# EAGLE design working (EAGLE 9.2.1)
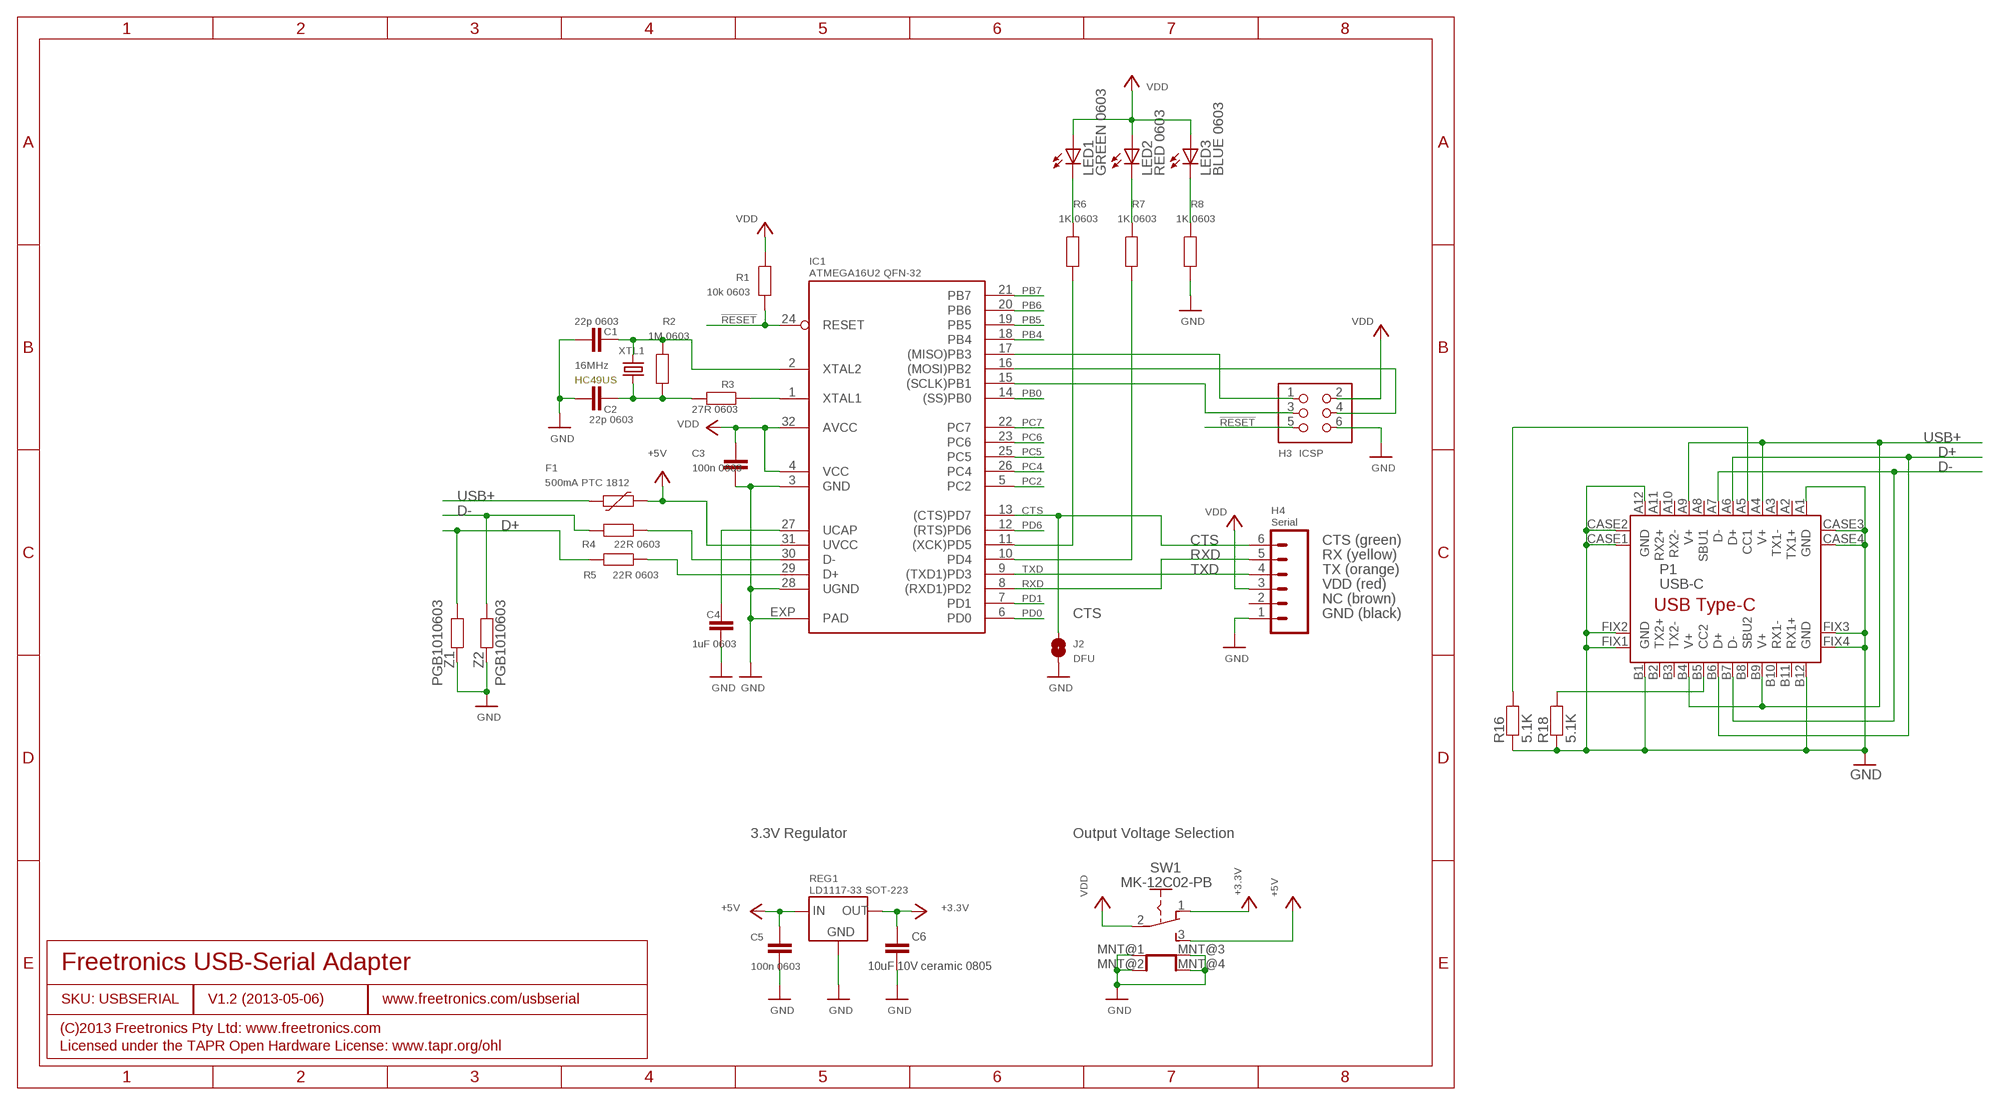
[diagram p0: schematic, sheet 1]

## Parts
C1  22p 0603  CAP0603  [0603]
C2  22p 0603  CAP0603  [0603]
C3  100n 0603  CAP0603  [0603]
C4  1uF 0603  CAP0603  [0603]
C5  100n 0603  CAP0603  [0603]
C6  10uF 10V ceramic 0805  C-EUC0805  [C0805]
F1  500mA PTC 1812  PTC  [1812]
H3  ICSP  HEADER_2X3  [HEADER_2X3]
H4  Serial  M06SIP  [1X06]
IC1  ATMEGA16U2 QFN-32  ATMEL_ATMEGA8U2-MUQFN  [ATMEL_QFN32]
J2  DFU  SJ  [SJ]
LED1  GREEN 0603  LED0603  [LED-0603]
LED2  RED 0603  LED0603  [LED-0603]
LED3  BLUE 0603  LED0603  [LED-0603]
P1  USB-C  [USB-C-U52A]
R1  10k 0603  RESISTOR0603  [0603]
R2  1M 0603  RESISTOR0603  [0603]
R3  27R 0603  RESISTOR0603  [0603]
R4  22R 0603  RESISTOR0603  [0603]
R5  22R 0603  RESISTOR0603  [0603]
R6  1K 0603  RESISTOR0603  [0603]
R7  1K 0603  RESISTOR0603  [0603]
R8  1K 0603  RESISTOR0603  [0603]
R16  5.1K  RESISTOR0603  [0603]
R18  5.1K  RESISTOR0603  [0603]
REG1  LD1117-33 SOT-223  LD1117-FIXED  [SOT-223]
SW1  MK-12C02-PB  SWITCH-SPDT-4TABSSMT  [MK-12C02]
XTL1  16MHz  CRYSTALHC49UV  [HC49U-V]
Z1  PGB1010603  RESISTOR0603  [0603]
Z2  PGB1010603  RESISTOR0603  [0603]

## Nets
!RESET: H3.5 IC1.24(RESET) R1.1
+3V3: C6.1 REG1.2(OUT) REG1.4(OUT) SW1.1(A) ; supply symbol labelled +3.3V
+5V: C5.1 F1.2 IC1.31(UVCC) REG1.3(IN) SW1.3(B)
CTS: H4.6 IC1.13((CTS)PD7) J2.2
D+: P1.A6(D+) P1.B6(D+) R5.2 Z1.1
D-: P1.A7(D-) P1.B7(D-) R4.2 Z2.1
GND: C1.1 C2.1 C3.2 C4.2 C5.2 C6.2 H3.6 H4.1 IC1.3(GND) IC1.28(UGND) IC1.EXP(PAD) J2.1 P1.A1(GND) P1.A12(GND) P1.B1(GND) P1.B12(GND) P1.CASE1(GND) P1.CASE2(GND) P1.CASE3(GND) P1.CASE4(GND) P1.FIX1(GND) P1.FIX2(GND) P1.FIX3(GND) P1.FIX4(GND) R8.1 R16.1 R18.1 REG1.1(GND) SW1.MNT@1(MNT) SW1.MNT@2(MNT) SW1.MNT@3(MNT) SW1.MNT@4(MNT) Z1.2 Z2.2
MISO: H3.1 IC1.17((MISO)PB3)
MOSI: H3.4 IC1.16((MOSI)PB2)
N$2: IC1.1(XTAL1) R3.1
N$3: LED1.C R6.2
N$4: P1.A5(CC1) R16.2
N$5: P1.B5(CC2) R18.2
N$7: LED2.C R7.2
N$9: LED3.C R8.2
N$113: C1.2 IC1.2(XTAL2) R2.2 XTL1.2
N$114: C2.2 R2.1 R3.2 XTL1.1
N$117: C4.1 IC1.27(UCAP)
PB0: IC1.14((SS)PB0)
PB4: IC1.18(PB4)
PB5: IC1.19(PB5)
PB6: IC1.20(PB6)
PB7: IC1.21(PB7)
PC2: IC1.5(PC2)
PC4: IC1.26(PC4)
PC5: IC1.25(PC5)
PC6: IC1.23(PC6)
PC7: IC1.22(PC7)
PD0: IC1.6(PD0)
PD1: IC1.7(PD1)
PD6: IC1.12((RTS)PD6)
RD+: IC1.29(D+) R5.1
RD-: IC1.30(D-) R4.1
RXD: H4.5 IC1.8((RXD1)PD2)
RXLED: IC1.10(PD4) R7.1
SCK: H3.3 IC1.15((SCLK)PB1)
TXD: H4.4 IC1.9((TXD1)PD3)
TXLED: IC1.11((XCK)PD5) R6.1
USB+: F1.1 P1.A4(V+) P1.A9(V+) P1.B4(V+) P1.B9(V+)
VDD: C3.1 H3.2 H4.3 IC1.4(VCC) IC1.32(AVCC) LED1.A LED2.A LED3.A R1.2 SW1.2(COM)
Unconnected: H4.2 P1.A2(TX1+) P1.A3(TX1-) P1.A8(SBU1) P1.A10(RX2-) P1.A11(RX2+) P1.B2(TX2+) P1.B3(TX2-) P1.B8(SBU2) P1.B10(RX1-) P1.B11(RX1+)

## Notes on the sheet
- HC49US
- CTS (green)
- RX (yellow)
- TX (orange)
- VDD (red)
- NC (brown)
- GND (black)
- 3.3V Regulator | Output Voltage Selection
- Freetronics USB-Serial Adapter
- SKU: USBSERIAL | V1.2 (2013-05-06) | www.freetronics.com/usbserial
- (C)2013 Freetronics Pty Ltd: www.freetronics.com
- Licensed under the TAPR Open Hardware License: www.tapr.org/ohl

## Library data of the parts
C1-C5 = freetronics:CAP: Capacitor Standard 0603 ceramic capacitor, and 0.1" leaded capacitor.
C6 = freetronics-jon:C-EU: CAPACITOR, European symbol
F1 = freetronics-luke:PTC: Polymeric PTC ("Polyfuse")
H3 = freetronics-luke:HEADER_2X3: 6-pin (2x3) 0.1" male through-hole pin header.
H4 = freetronics-master-v1:M06: Header 6 Standard 6-pin 0.1" header. Use with straight break away headers (SKU : PRT-00116), right angle break away headers (PRT-00553), swiss pins (PRT-00743), machine pins (PRT-00117), and female headers (PRT-00115). Molex polarized connector foot print use with SKU : PRT-08094 with associated crimp pins and housings. NOTES ON THE VARIANTS LOCK and LOCK_LONGPADS... This footprint was designed to help hold the alignment of a through-hole component (i.e. 6-pin header) while soldering it into place. You may notice that each hole has been shifted either up or down by 0.005 of an inch from it's more standard position (which is a perfectly straight line). This slight alteration caused the pins (the squares in the middle) to touch the edges of the holes. Because they are alternating, it causes a "brace" to hold the component in place. 0.005 has proven to be the perfect amount of "off-center" position when using our standard breakaway headers. Although looks a little odd when you look at the bare footprint, once you have a header in there, the alteration is very hard to notice. Also, if you push a header all the way into place, it is covered up entirely on the bottom side. This idea of altering the position of holes to aid alignment will be further integrated into the Sparkfun Library for other footprints. It can help hold any component with 3 or more connection pins.
IC1 = freetronics-jon:ATMEL_ATMEGA8U2-MU
J2 = freetronics-luke:SJ: PCB "solder jumper". Note that there should nothing on the BOM corresponding to this "component".
LED1-LED3 = freetronics-jon:LED: LEDs Standard schematic elements and footprints for 5mm, 3mm, 1206, and 0603 sized LEDs. 5mm - Spark Fun Electronics SKU : COM-00529 (and others)
P1 = freetronics-jon:USB-C
R1-R8 Z1 Z2 = freetronics:RESISTOR: Resistor Basic schematic elements and footprints for 0603, 1206, and PTH 1/10th watt (small) resistors.
R16 R18 = freetronics-original:RESISTOR: Resistor Basic schematic elements and footprints for 0603, 1206, and PTH 1/10th watt (small) resistors.
REG1 = freetronics-luke:LD1117-FIXED: Fixed-voltage LD1117 series LDOs in SOT-223 package. Note that the ground pin is labelled as ground, not as adj, because it's not the adjustable-voltage part.
SW1 = freetronics-jon:SWITCH-SPDT-4TABS
XTL1 = freetronics-jon:CRYSTAL: Crystals Various standard crystals. Proven footprints. Spark Fun Electronics SKU : COM-00534

## Net classes
0 default: width 0.152 mm, drill 0.241 mm, clearance 0.152 mm

## Board
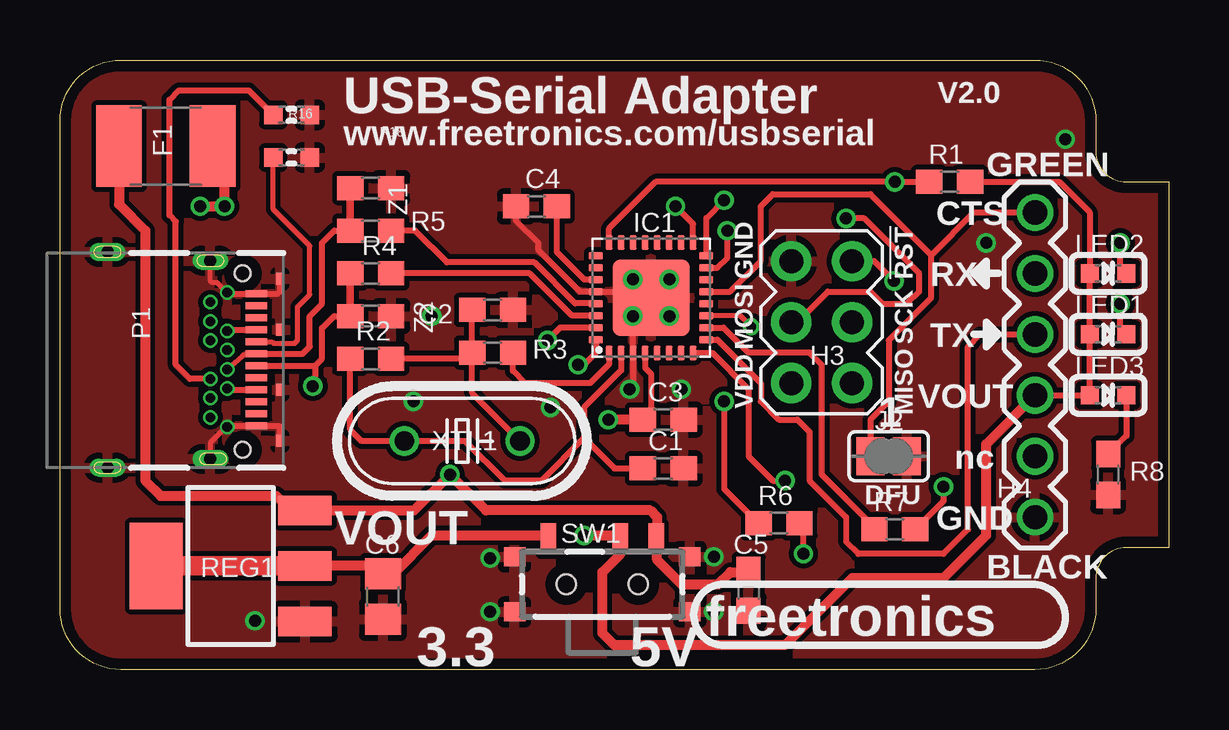
[diagram p1: board, top side]
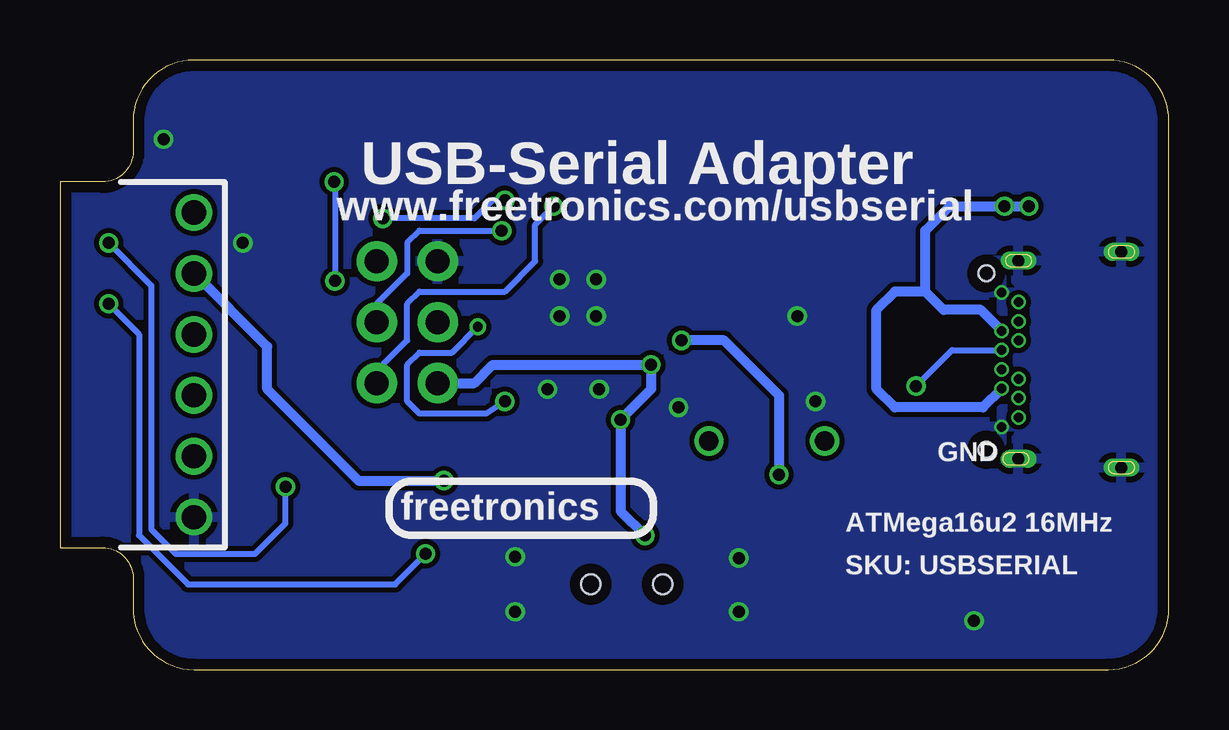
[diagram p2: board, bottom side, seen from below]

Size 46.23 x 25.4 mm. Coordinates in mm from the lower left corner, seen from the top.
Outline: 0,22.86 arc-90 2.54,25.4 40.64,25.4 arc-90 43.18,22.86 43.18,21.59 arc90 44.45,20.32 46.23,20.32 46.23,5.08 44.45,5.08 arc90 43.18,3.81 43.18,2.54 arc-90 40.64,0 2.54,0 arc-90 0,2.54 0,22.86
Copper layers (1*16): Top 0.035mm / dielectric 1.5mm / Bottom 0.035mm
Design rules "USB-C-design-rules": minimum track width 8mil, minimum drill 15mil, track to track 8mil, track to pad 8mil, pad to pad 8mil, via to via 8mil, smd to smd 6mil, copper to edge 18mil, drill to drill 8mil, minimum pad ring 4mil, minimum via ring 6mil, stop-mask expansion 4mil, vias tented up to drill 25mil, thermal gap 10mil

### Footprints (pad centres in the part's own frame; a part is rotated, then mirrored left to right if it is on the bottom)
0603 = smd 1.1 x 1: 1 -0.85,0; 2 0.85,0
C0805 = smd 1.3 x 1.5: 1 -0.95,0; 2 0.95,0
1812 = smd 1.9 x 3.4: 1 -1.95,0; 2 1.95,0
HEADER_2X3 = drill 1 pad 1.676: 1 -2.54,-1.27; 2 -2.54,1.27; 3 0,-1.27; 4 0,1.27; 5 2.54,-1.27; 6 2.54,1.27
1X06 = drill 1.016: 1 0,0; 2 2.54,0; 3 5.08,0; 4 7.62,0; 5 10.16,0; 6 12.7,0
ATMEL_QFN32 = smd 0.6 x 0.3: 1 -2.3,1.75; 2 -2.3,1.25; 3 -2.3,0.75; 4 -2.3,0.25; 5 -2.3,-0.25; 6 -2.3,-0.75; 7 -2.3,-1.25; 8 -2.3,-1.75; 17 2.3,-1.75; 18 2.3,-1.25; 19 2.3,-0.75; 20 2.3,-0.25; 21 2.3,0.25; 22 2.3,0.75; 23 2.3,1.25; 24 2.3,1.75 | smd 0.3 x 0.6: 9 -1.75,-2.3; 10 -1.25,-2.3; 11 -0.75,-2.3; 12 -0.25,-2.3; 13 0.25,-2.3; 14 0.75,-2.3; 15 1.25,-2.3; 16 1.75,-2.3; 25 1.75,2.3; 26 1.25,2.3; 27 0.75,2.3; 28 0.25,2.3; 29 -0.25,2.3; 30 -0.75,2.3; 31 -1.25,2.3; 32 -1.75,2.3 | smd 3.2 x 3.2: EXP 0,0
SJ = smd 1.168 x 1.6: 1 -0.762,0; 2 0.762,0
LED-0603 = smd 0.762 x 0.762: A -0.762,0; C 0.762,0
USB-C-U52A = smd 0.3 x 0.9: A1 0.85,0.56; A2 1.35,0.56; A3 1.85,0.56; A4 2.35,0.56; A5 2.85,0.56; A6 3.35,0.56; A7 3.85,0.56; A8 4.35,0.56; A9 4.85,0.56; A10 5.35,0.56; A11 5.85,0.56; A12 6.35,0.56 | drill 0.4 pad 0.6: B1 6.4,-0.65; B2 6,-1.35; B3 5.2,-1.35; B4 4.8,-0.65; B5 4.4,-1.35; B6 4,-0.65; B7 3.2,-0.65; B8 2.8,-1.35; B9 2.4,-0.65; B10 2,-1.35; B11 1.2,-1.35; B12 0.8,-0.65 | smd 0.5 x 0.3: CASE1 0.23,1.55; CASE2 2.35,1.55; CASE3 4.85,1.55; CASE4 6.98,1.55 | drill 0.5 pad 0.7 long: FIX1 -0.89,-5.64; FIX2 -0.53,-1.35; FIX3 7.73,-1.35; FIX4 8.09,-5.64 | hole 0.65: 7.35,0; 0,0
0603' = smd 0.762 x 0.762: 1 -0.762,0; 2 0.762,0
SOT-223 = smd 1.219 x 2.235: 1 -2.311,-3.099; 2 0,-3.099; 3 2.311,-3.099 | smd 3.6 x 2.2: 4 0,3.099
MK-12C02 = smd 0.635 x 1.27: 1 -2.25,1.9; 2 0.75,1.9; 3 2.25,1.9 | smd 0.9 x 0.8: MNT@1 -3.65,1.15; MNT@2 -3.65,-1.15; MNT@3 3.65,1.15; MNT@4 3.65,-1.15 | hole 0.8: -1.5,0; 1.5,0
HC49U-V = drill 0.813: 1 -2.413,0; 2 2.413,0

### Placement (x,y rotation side)
C1  25.15,8.38 180 top
C2  18.03,14.99 180 top
C3  25.15,10.41 0 top
C4  19.86,19.3 180 top
C5  28.7,3.3 270 top
C6  13.46,3.05 270 top
F1  4.41,21.81 180 top
H3  31.75,14.48 90 top
H4  40.64,6.35 90 top
IC1  24.64,15.49 90 top
J2  34.54,8.89 180 top
LED1  43.69,13.97 0 top
LED2  43.69,16.51 0 top
LED3  43.69,11.43 0 top
P1  7.62,16.51 270 top
R1  37.08,20.32 0 top
R2  12.95,12.95 180 top
R3  18.03,13.21 180 top
R4  12.95,16.51 180 top
R5  12.95,18.29 180 top
R6  29.97,6.1 0 top
R7  34.8,5.84 0 top
R8  43.69,8.13 90 top
R16  5.1K  [0603']  9.65,21.34 180 top
R18  5.1K  [0603']  9.65,23.11 180 top
REG1  7.11,4.32 90 top
SW1  22.61,3.56 0 top
XTL1  16.76,9.53 180 top
Z1  12.95,20.07 0 top
Z2  12.95,14.73 0 top

### Tracks (layer width: path | path; a pad name or v marks a point on that pad's centre or on a via)
!RESET  (via drill 0.5)
  Top 0.254: R1.1 v34.8,20.32 24.83,20.32 22.89,18.38 IC1.24 | H3.5 33.94,17.02 v34.77,16.19
  Bottom 0.254: v34.77,16.19 34.77,20.32 v34.8,20.32
+3V3
  Top 0.406: REG1.2 13.46,4.32 C6.1 13.9,4 15.49,5.59 20.22,5.59 SW1.1
  Top 0.813: REG1.2 REG1.4
+5V  (via drill 0.5)
  Top 0.254: IC1.31 20.85,14.24 v20.32,13.72
  Top 0.406: C5.1 28.61,4.06 27.94,4.06 27.43,3.56 25.91,3.56 24.89,4.57 24.89,5.42 SW1.3 24.89,5.49 24.89,6.35 24.61,6.63 17.75,6.63 v16.26,8.13 14.76,6.63 REG1.3 9.63,6.63 9.02,7.24 4.19,7.24 3.56,7.87 3.56,18.29 2.46,19.38 F1.2
  Bottom 0.406: v16.26,8.13 16.26,11.43 18.54,13.72 v20.32,13.72
CTS
  Top 0.254: IC1.13 27.94,15.74 29.21,17.02 29.21,19.3 29.72,19.81 33.78,19.81 36.32,17.27 | 36.32,17.27 36.32,15.49 34.54,13.72 34.54,11.18 33.78,10.41 J2.2 | 36.32,17.27 38.1,19.05 H4.6
D+
  Top 0.203: P1.B6 7.62,13.08 7.7,13.16 P1.A6
  Top 0.254: P1.A6 10.11,13.16 10.41,13.46 10.41,14.73 10.92,15.24 10.92,17.78 11.43,18.29 R5.2
  Top 0.305: Z1.1 R5.2
D-  (via drill 0.5)
  Top 0.254: P1.A7 10.63,12.66 | 10.63,12.66 10.92,12.95 10.92,14.22 11.43,14.73 Z2.1 | 10.63,12.66 10.63,11.9 v10.54,11.81
  Top 0.305: R4.2 Z2.1
  Bottom 0.254: v10.54,11.81 9.04,13.31 P1.B7
GND  (via drill 0.5)
  Top 0.203: P1.B12 6.55,16.13 6.35,16.13 6.27,16.21 P1.FIX2 | P1.B1 6.93,10.11 6.27,9.45 P1.FIX3
  Top 0.254: 23.97,14.73 23.97,14.61 23.89,14.52 IC1.3 23.89,11.82 v23.75,11.68 | 23.97,14.73 23.97,14.83 | v23.88,14.73 23.97,14.73 | P1.CASE1 9.17,15.77 9.06,15.66 P1.A1 7.02,15.66 P1.B12 | P1.CASE4 9.14,9.56 9.14,10.16 P1.A12 7.02,10.16 P1.B1 | IC1.EXP 24.39,15.74 IC1.28 21.67,15.75 19.94,17.48 19.94,17.78 19.01,18.71 C4.2
  Top 0.406: 23.97,14.83 IC1.EXP
  other vias: 41.91,22.1 15.49,14.73 8.13,2.03 20.45,10.92 14.73,11.18 25.4,16.26 23.88,16.26 25.4,14.73 25.91,11.68 38.61,17.78 17.93,2.41 17.93,4.65 27.25,2.41 27.25,4.7
  pour Bottom: 0,25.4 43.18,25.4 43.18,21.59 arc90 44.45,20.32 46.23,20.32 46.23,5.08 44.45,5.08 arc90 43.18,3.81 43.18,0 0,0
  pour Top: 0,25.4 43.18,25.4 43.18,21.59 arc90 44.45,20.32 46.23,20.32 46.23,5.08 44.45,5.08 arc90 43.18,3.81 43.18,0 0,0
MISO  (via drill 0.5)
  Top 0.254: IC1.17 26.39,18.57 v25.65,19.3
  Bottom 0.254: H3.1 33.02,12.45 31.75,13.72 31.75,15.24 31.24,15.75 27.69,15.75 26.42,17.02 26.42,18.54 v25.65,19.3
MOSI  (via drill 0.5)
  Top 0.254: IC1.16 26.94,18.81 v27.69,19.56 | H3.4 30.73,14.48 32,15.75 33.78,15.75 34.29,15.24 35.31,15.24 35.81,15.75 35.81,16.51 33.53,18.8 v32.77,18.8
  Bottom 0.254: v27.69,19.56 28.19,19.56 28.96,18.8 v32.77,18.8
N$2
  Top 0.254: IC1.1 22.89,12.73 22.1,11.94 19.39,11.94 18.88,12.45 R3.1
N$3  (via drill 0.5)
  Top 0.254: LED1.C 44.2,14.22 v44.2,15.24 | v30.99,4.83 30.99,5.93 R6.2
  Bottom 0.254: v44.2,15.24 42.93,13.97 42.93,5.59 40.89,3.56 32.26,3.56 v30.99,4.83
N$4
  Top 0.203: P1.A5 8.84,13.66 8.91,13.59 9.78,13.59 9.91,13.72 9.91,15.11 10.41,15.62 10.41,17.65 8.89,19.18 R16.2
N$5
  Top 0.254: P1.B5 5.42,12.11 4.83,12.7 4.83,18.67 4.57,18.92 4.57,23.75 4.95,24.13 7.87,24.13 R18.2
N$7  (via drill 0.5)
  Top 0.254: LED2.C 44.2,16.76 v44.2,17.78 | v36.83,7.62 36.83,7.02 R7.2
  Bottom 0.254: v44.2,17.78 42.42,16 42.42,5.84 41.4,4.83 38.1,4.83 36.83,6.1 v36.83,7.62
N$9
  Top 0.254: LED3.C 44.45,9.74 R8.2
N$113
  Top 0.254: IC1.2 23.39,12.47 21.84,10.92 21.84,9.65 | 21.84,9.65 23.11,8.38 C1.2 | 21.84,9.65 20.07,7.87 18.54,7.87 16.89,9.53 XTL1.2 12.57,9.53 12.1,9.99 R2.2
N$114
  Top 0.254: C2.2 17.23,14.94 17.18,14.9 R3.2 | R3.2 16.93,12.95 R2.1 | XTL1.1 17.18,11.52 R3.2
N$117
  Top 0.254: IC1.27 21.86,16.24 20.71,17.39 C4.1
RD+
  Top 0.254: IC1.29 22.32,15.26 21.48,15.26 19.77,16.97 16.13,16.97 14.81,18.29 R5.1
RD-
  Top 0.254: IC1.30 21.35,14.74 19.58,16.51 R4.1
RXD  (via drill 0.5)
  Top 0.254: IC1.8 27.19,13.19 28.7,11.68 28.7,8.89 29.72,7.87 v30.23,7.87
  Bottom 0.406: v30.23,7.87 33.78,7.87 37.59,11.68 37.59,13.46 H4.5
RXLED
  Top 0.254: IC1.10 27.67,14.24 28.7,13.21 31.24,13.21 31.75,12.7 31.75,8.13 34.04,5.84 R7.1
SCK  (via drill 0.5)
  Top 0.254: IC1.15 27.41,16.74 27.81,17.14 v27.81,18.29
  Bottom 0.254: H3.3 33.02,15.24 31.75,16.51 31.75,17.78 31.24,18.29 v27.81,18.29
TXD
  Top 0.254: IC1.9 27.4,13.74 29.21,11.94 29.21,11.18 29.97,10.41 30.73,10.41 31.24,9.91 31.24,7.87 32.77,6.35 32.77,5.33 33.27,4.83 36.83,4.83 37.85,5.84 37.85,13.46 38.35,13.97 H4.4
TXLED  (via drill 0.4, 0.5)
  Top 0.203: IC1.11 28.36,14.74 v28.81,14.29
  Top 0.254: v27.69,11.18 27.69,7.53 R6.1
  Bottom 0.254: v27.69,11.18 28.45,10.67 31.24,10.67 31.75,11.18 31.75,12.7 31.24,13.21 29.89,13.21 v28.81,14.29
USB+  (via drill 0.5)
  Top 0.254: P1.B9 7.02,14.16 P1.A4 | P1.B4 7.02,11.66 P1.A9
  Top 0.406: v5.84,19.3 v6.86,19.3 6.86,21.32 F1.1
  Bottom 0.406: P1.B4 7.76,10.92 11.43,10.92 12.19,11.68 12.19,14.99 11.43,15.75 10.16,15.75 | P1.B9 7.85,14.99 9.4,14.99 10.16,15.75 | 10.16,15.75 10.16,18.29 9.14,19.3 v5.84,19.3
VDD  (via drill 0.5)
  Top 0.254: IC1.32 22.34,13.19 21.84,12.7 v21.59,12.7 | R1.2 41.66,20.32 42.93,19.05 LED2.A LED1.A LED3.A H4.3 | IC1.4 24.39,12.57 24.64,12.32 24.64,10.76 C3.1
  Top 0.406: H4.3 38.61,9.4 38.61,5.59 36.83,3.81 33.02,3.81 30.23,1.02 23.11,1.02 22.61,1.52 22.61,4.06 23.36,4.81 SW1.2 23.22,5.59 v21.84,5.59 | C3.1 v22.86,10.41
  Bottom 0.406: H3.2 28.96,11.94 28.19,12.7 v21.59,12.7 21.59,11.68 v22.86,10.41 22.86,6.6 v21.84,5.59

### Text on the board
tPlace: V2.0 | USB-Serial Adapter | www.freetronics.com/usbserial | GREEN | CTS | GND | !RST | RX | SCK | MOSI | TX | VDD | MISO | VOUT | 1 | nc | DFU | GND | VOUT | BLACK | freetronics | 3.3 | 5V
bPlace: USB-Serial Adapter | www.freetronics.com/usbserial | GND | ATMega16u2 16MHz | freetronics | SKU: USBSERIAL
tDocu: A | K | A | K | A | K